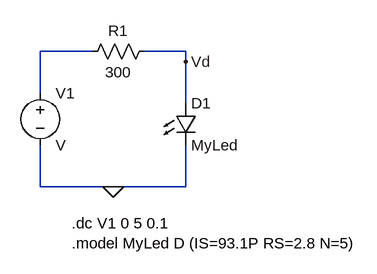
[diagram p0: schematic Draft29.asc]
Draft29.asc, the LTspice schematic file:
Version 4
SHEET 1 1016 680
WIRE -16 224 -96 224
WIRE 128 224 64 224
WIRE 128 240 128 224
WIRE -96 288 -96 224
WIRE 128 304 128 240
WIRE -96 432 -96 368
WIRE 16 432 -96 432
WIRE 128 432 128 368
WIRE 128 432 16 432
FLAG 16 432 0
FLAG 128 240 Vd
SYMBOL voltage -96 272 R0
SYMATTR InstName V1
SYMBOL res 80 208 R90
WINDOW 0 0 56 VBottom 2
WINDOW 3 32 56 VTop 2
SYMATTR InstName R1
SYMATTR Value 300
SYMBOL LED 112 304 R0
SYMATTR InstName D1
SYMATTR Value MyLed
TEXT -48 488 Left 2 !.dc V1 0 5 0.1\n.model MyLed D (IS=93.1P RS=2.8 N=5)

The netlist it stands for:
* Draft29.asc
V1 N001 0 V
R1 Vd N001 300
D1 Vd 0 MyLed
.model D D
.lib standard.dio
.dc V1 0 5 0.1
.model MyLed D (IS=93.1P RS=2.8 N=5)
.backanno
.end